# EAGLE design akabeacon_square_type1_ble121 (EAGLE 7.2.0)
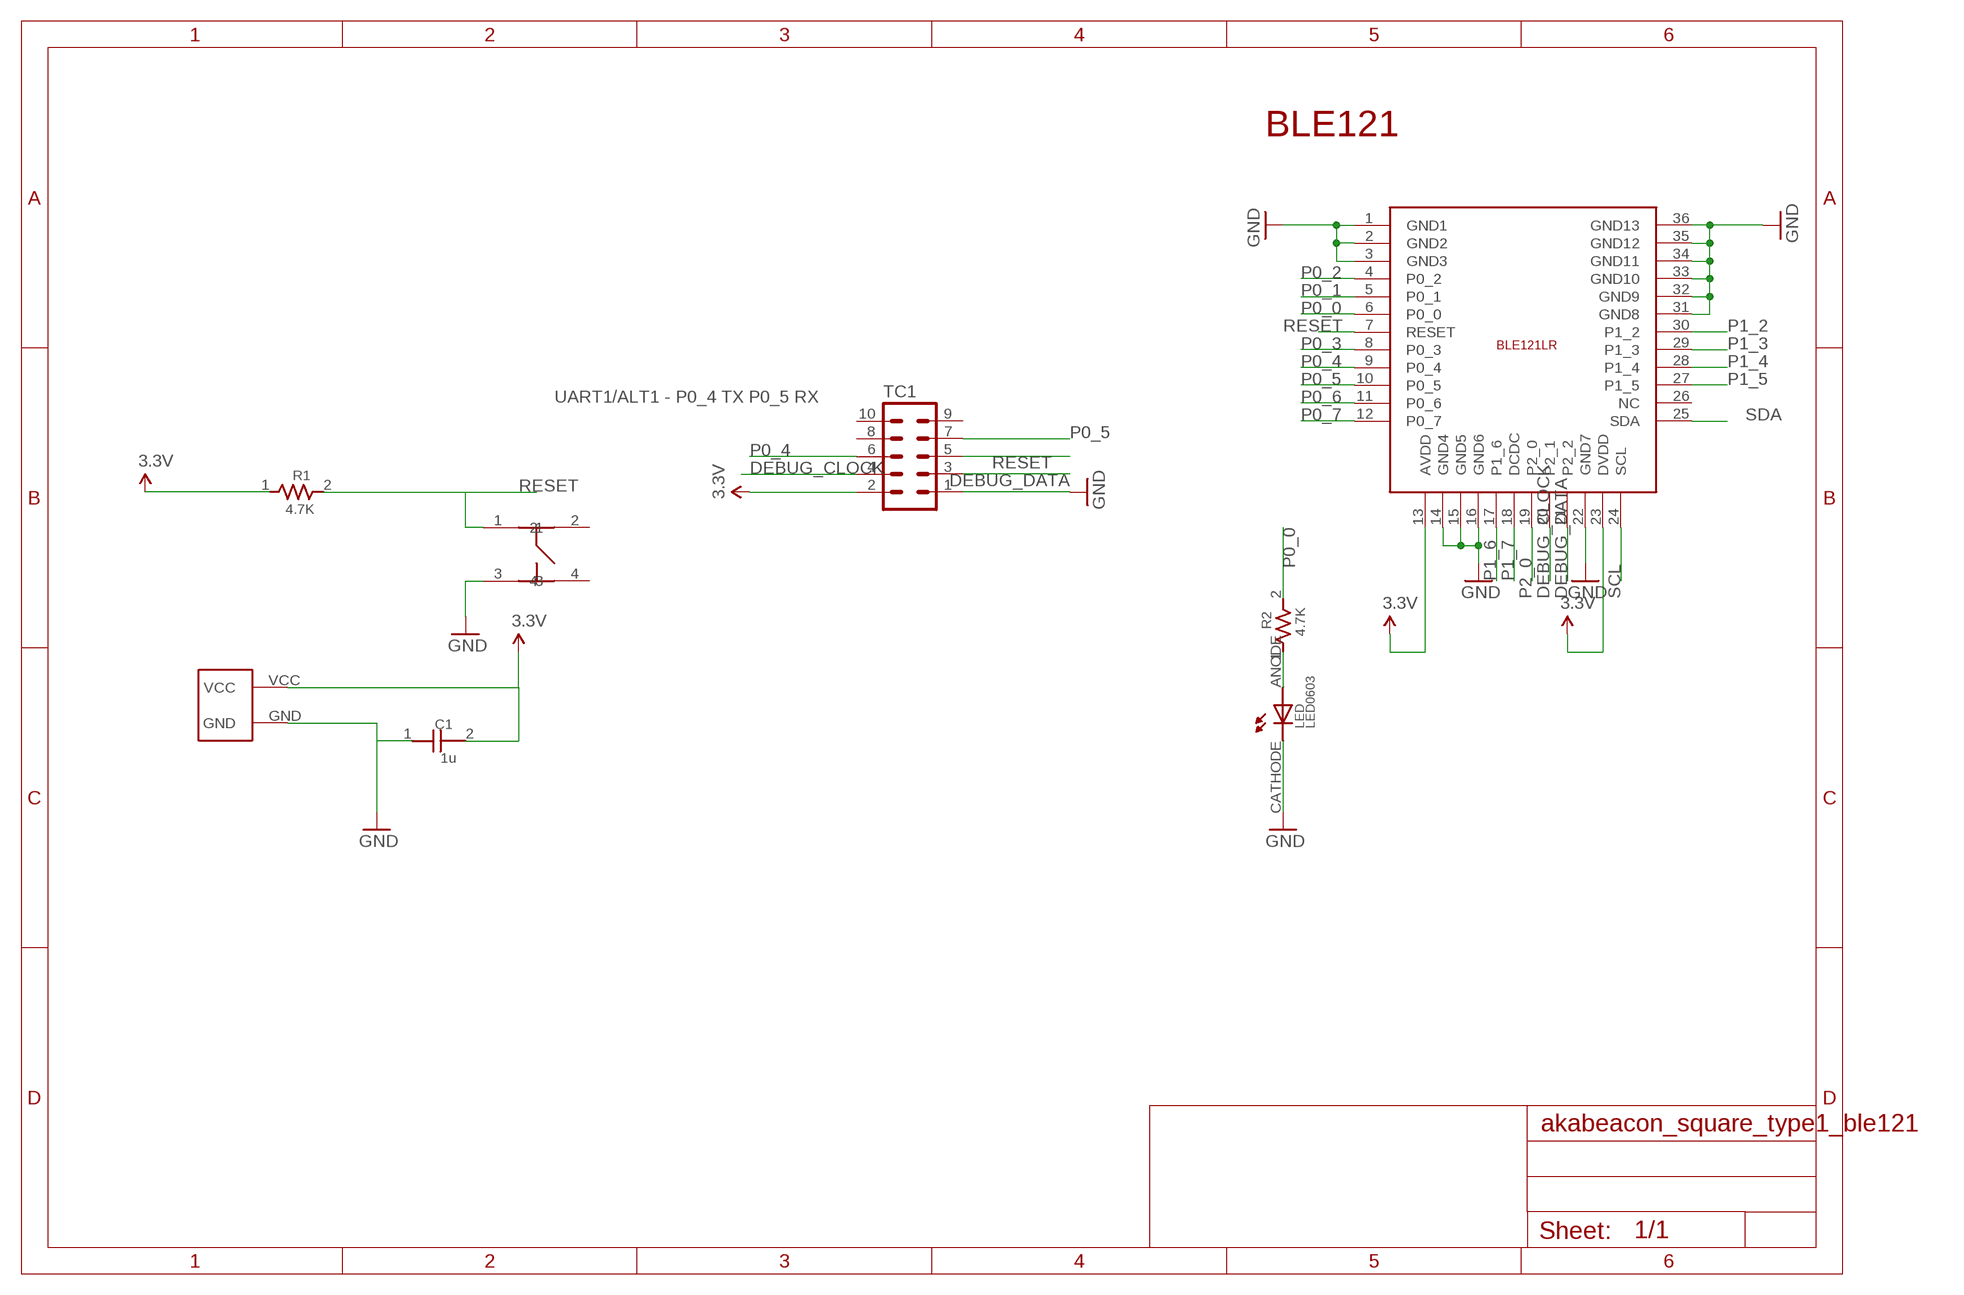
[diagram p0: schematic, sheet 1]

## Parts
BLE1  BLUEGIGA-BLE121LR  [BLUEGIGA-BLE121LR]
C1  1u  CAPACITOR0603  [0603]
LED  LED0603  [0603]
R1  4.7K  RESISTOR0603  [0603]
R2  4.7K  RESISTOR0603  [0603]
TC1  TC2050-IDC-NL  [TC2050-IDC-NL]
U$2  SQUARE-TYPE1  [SQUARE-TYPE1-TC2030]
U$6  SWICTH-4P(KMR2)  [SWITCH-4P(KMR2)]

## Nets
3.3V: BLE1.13(AVDD) BLE1.23(DVDD) C1.2 R1.1 TC1.2 U$2.VCC
DEBUG_CLOCK: BLE1.20(P2_1) TC1.4
DEBUG_DATA: BLE1.21(P2_2) TC1.3
GND: BLE1.1(GND1) BLE1.2(GND2) BLE1.3(GND3) BLE1.22(GND7) BLE1.31(GND8) BLE1.32(GND9) BLE1.33(GND10) BLE1.34(GND11) BLE1.35(GND12) BLE1.36(GND13) C1.1 LED.CATHODE TC1.1 U$2.GND U$6.3
N$2: LED.ANODE R2.1
N$8: BLE1.14(GND4) BLE1.15(GND5) BLE1.16(GND6) ; supply symbol labelled GND
P0_0: BLE1.6(P0_0) R2.2
P0_1: BLE1.5(P0_1)
P0_2: BLE1.4(P0_2)
P0_3: BLE1.8(P0_3)
P0_4: BLE1.9(P0_4) TC1.6
P0_5: BLE1.10(P0_5) TC1.7
P0_6: BLE1.11(P0_6)
P0_7: BLE1.12(P0_7)
P1_2: BLE1.30(P1_2)
P1_3: BLE1.29(P1_3)
P1_4: BLE1.28(P1_4)
P1_5: BLE1.27(P1_5)
P1_6: BLE1.17(P1_6)
P1_7: BLE1.18(DCDC)
P2_0: BLE1.19(P2_0)
RESET: BLE1.7(RESET) R1.2 TC1.5 U$6.1
SCL: BLE1.24(SCL)
SDA: BLE1.25(SDA)
Unconnected: BLE1.26(NC) TC1.8 TC1.9 TC1.10 U$6.2 U$6.4

## Notes on the sheet
- BLE121
- UART1/ALT1 - P0_4 TX P0_5 RX

## Library data of the parts
BLE1 = gclueBT:BLUEGIGA-BLE121LR: Bluetooth Bluetooth 4.0 low energy radio Radio Transmit power: +8 dBm Receiver sensitivity: -98 dBm Typical line-of-sight range: up to 450 meters Current Consumption TX peak current: 36 mA, 25 mA (with DC/DC) RX peak current: 33 mA Power mode 1: 2.7 mA Power mode 2: 1.3 uA Power mode 3: 0.5 uA Certifications Japan: MIC Japan certification ( 209-J00111 )
C1 = GClue-Capacitor:CAPACITOR
LED = GClue-LED:LED
R1 R2 = GClue-Resistors:RESISTOR
TC1 = TagConnect:TC2050-IDC: Tag-Connect In Circuit Programming & Debug Cable 10 Pin http://www.tag-connect.com
U$2 = GClue-Beacon:SQUARE-TYPE1
U$6 = gclue:SWICTH-4P(KMR2)

## Board
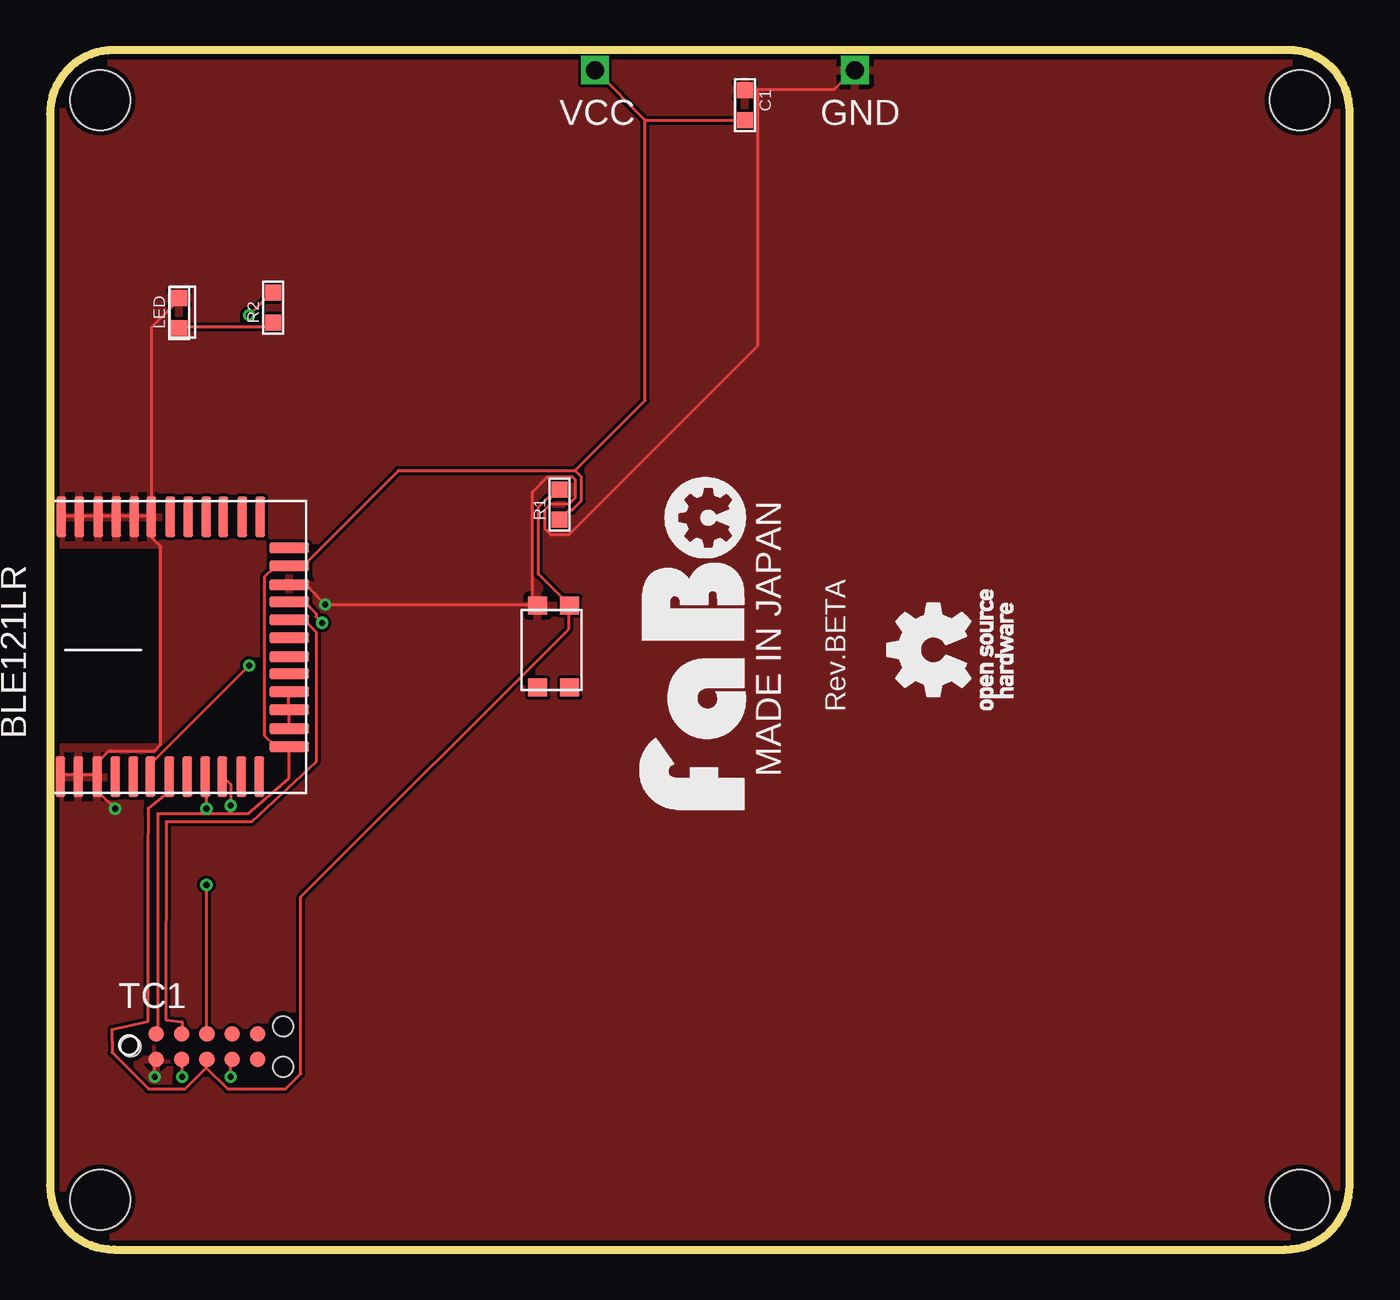
[diagram p1: board, top side]
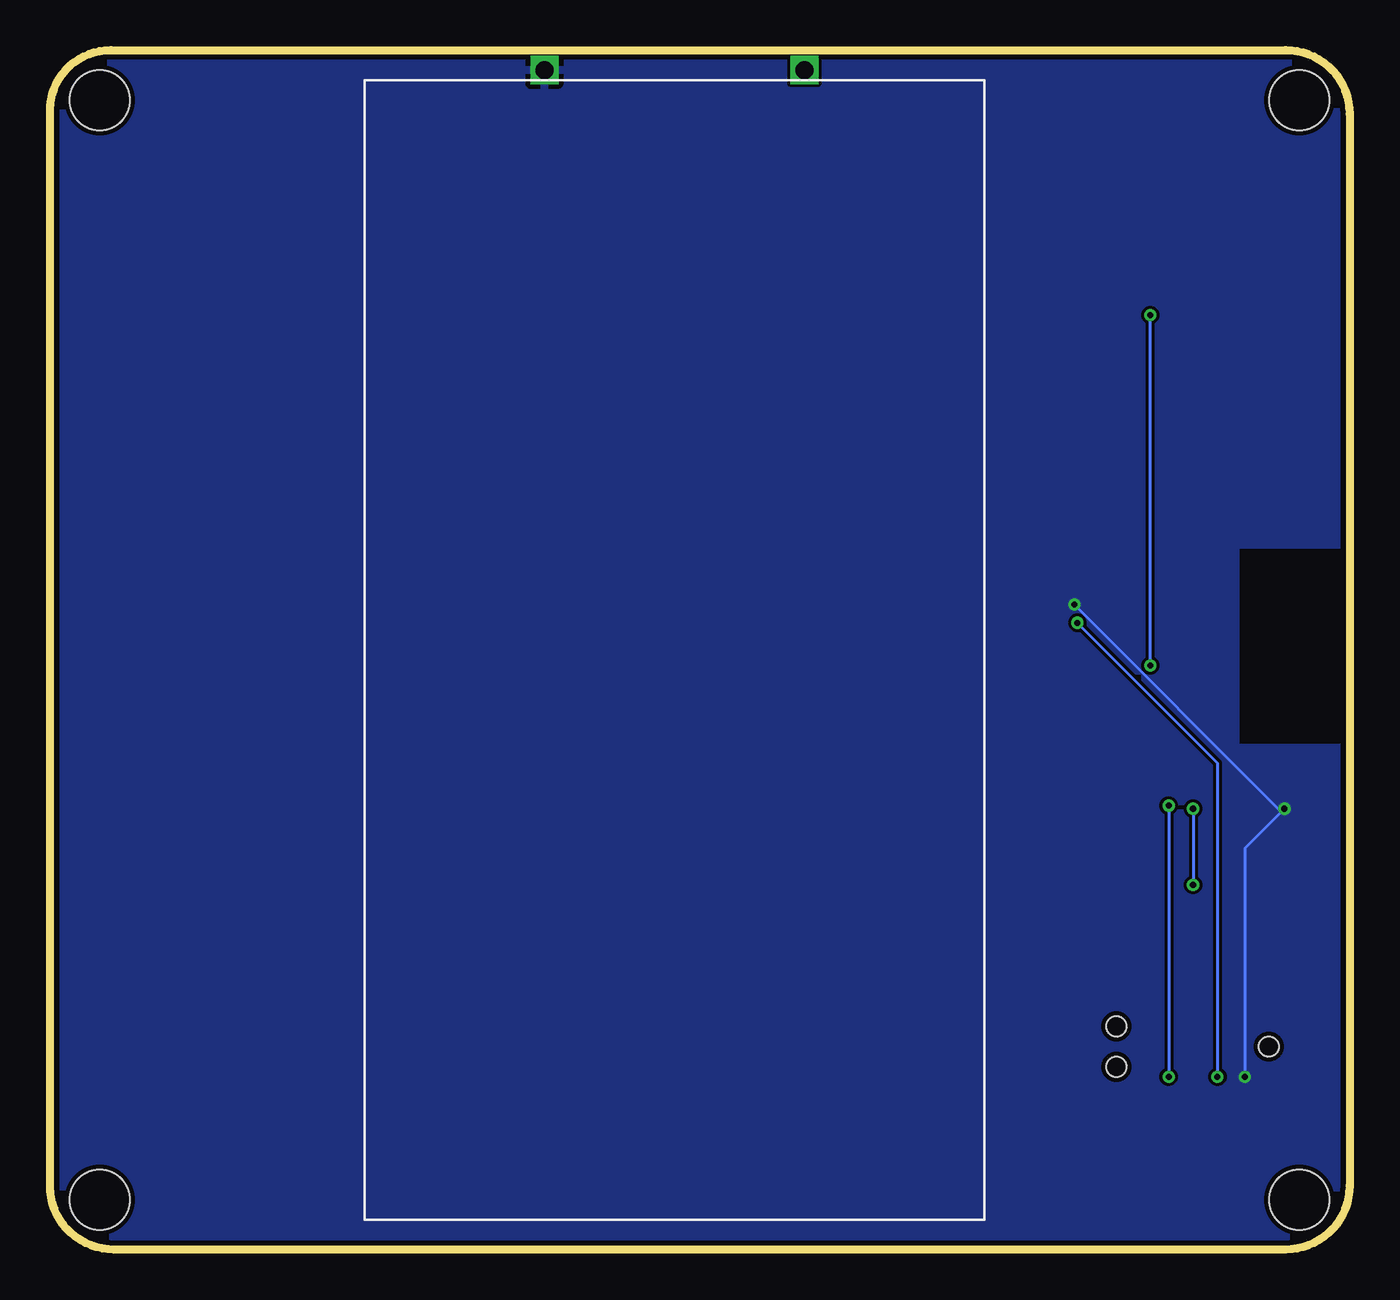
[diagram p2: board, bottom side, seen from below]

Size 65 x 60 mm. Coordinates in mm from the lower left corner, seen from the top.
Copper layers (1*16): Top 0.035mm / dielectric 1.5mm / Bottom 0.035mm
Design rules "SeeedStudio_2layer_DRU_no_angle_20140221": minimum track width 6mil, minimum drill 12mil, track to track 6mil, track to pad 6mil, pad to pad 6mil, via to via 6mil, smd to smd 0mil, copper to edge 10mil, drill to drill 10mil, minimum pad ring 10mil, minimum via ring 6mil, stop-mask expansion 2mil, vias tented up to drill 100mil, thermal gap 10mil
tRestrict: area -4.2,25.3 to 5.4,35
bRestrict: area -4.2,25.3 to 5.5,35

### Footprints (pad centres in the part's own frame; a part is rotated, then mirrored left to right if it is on the bottom)
BLUEGIGA-BLE121LR = smd 2 x 0.5: 1 -6.4,4.8; 2 -6.4,3.9; 3 -6.4,2.95; 4 -6.4,2.05; 5 -6.4,1.15; 6 -6.4,0.3; 7 -6.4,-0.65; 8 -6.4,-1.55; 9 -6.4,-2.45; 10 -6.4,-3.3; 11 -6.4,-4.25; 12 -6.4,-5.15; 25 6.6,-5.2; 26 6.6,-4.3; 27 6.6,-3.35; 28 6.6,-2.5; 29 6.6,-1.6; 30 6.6,-0.7; 31 6.6,0.25; 32 6.6,1.1; 33 6.6,2; 34 6.6,2.9; 35 6.6,3.85; 36 6.6,4.75 | smd 0.5 x 2: 13 -4.9,-6.65; 14 -4,-6.65; 15 -3.05,-6.65; 16 -2.15,-6.65; 17 -1.25,-6.65; 18 -0.4,-6.65; 19 0.55,-6.65; 20 1.45,-6.65; 21 2.35,-6.65; 22 3.2,-6.65; 23 4.15,-6.65; 24 5.05,-6.65
0603 = smd 0.8 x 0.8: 1 -0.75,0; 2 0.75,0
0603' = smd 0.8 x 0.8: ANODE -0.75,0; CATHODE 0.75,0
TC2050-IDC-NL = smd 0.787 x 0.787: 1 -2.54,-0.635; 2 -2.54,0.635; 3 -1.27,-0.635; 4 -1.27,0.635; 5 0,-0.635; 6 0,0.635; 7 1.27,-0.635; 8 1.27,0.635; 9 2.54,-0.635; 10 2.54,0.635 | hole 0.991: -3.81,0; 3.81,1.016; 3.81,-1.016
SQUARE-TYPE1-TC2030 = drill 0.9 square: GND 7.77,29; VCC -5.23,29 | hole 3: 30.02,27.48; 30.02,-27.52; -29.98,-27.52; -29.98,27.48
SWITCH-4P(KMR2) = smd 0.9 x 0.95: 1 -1,0; 2 3.1,0; 3 -1,-1.6; 4 3.1,-1.6

### Placement (x,y rotation side)
BLE1  5.32,30.05 90 top
C1  34.76,57.23 270 top
LED  LED0603  [0603']  6.46,46.84 90 top
R1  25.49,37.26 90 top
R2  11.16,47.12 90 top
TC1  7.85,10.15 0 top
U$2  32.5,30 0 top
U$6  25.99,31.21 270 top

### Tracks (layer width: path | path; a pad name or v marks a point on that pad's centre or on a via)
3.3V
  Top 0.152: TC1.2 5.39,10.93 5.39,17.02 5.39,21.8 9.9,21.8 11.94,23.57 11.94,25.1 BLE1.13 11.94,25.25 11.18,25.25 10.72,25.71 10.72,33.63 11.18,34.09 11.94,34.09 BLE1.23 12.09,34.24 12.7,34.24 17.43,38.97 26.26,38.97 | 29.77,56.49 34.65,56.49 C1.2 | 29.77,56.49 27.33,58.93 U$2.VCC | 26.26,38.97 26.57,38.66 26.57,37.44 26.11,36.99 25.96,36.99 25.5,36.53 R1.1 | 29.77,56.49 29.77,42.47 26.26,38.97
DEBUG_CLOCK
  Top 0.152: TC1.4 6.61,10.93 6.61,11.4 5.8,11.5 5.81,21.4 10.1,21.4 13.31,24.39 13.31,30.89 12.7,31.5 12.09,31.5 BLE1.20
DEBUG_DATA  (via drill 0.3)
  Top 0.152: v6.61,8.64 6.61,9.4 TC1.3 | v13.62,31.35 13.31,31.65 13.31,31.8 12.85,32.26 12.09,32.26 BLE1.21
  Bottom 0.152: v6.61,8.64 6.61,24.34 v13.62,31.35
GND  (via drill 0.3)
  Top 0.152: BLE1.36 0.66,36.68 1.42,36.68 BLE1.35 1.58,36.68 2.34,36.68 BLE1.34 2.49,36.68 3.25,36.68 BLE1.33 3.4,36.68 4.17,36.68 BLE1.32 4.32,36.68 4.93,36.68 BLE1.31 | LED.CATHODE 6.45,47.5 5.08,46.13 5.08,36.68 BLE1.31 | BLE1.1 0.66,23.73 1.27,23.73 BLE1.2 1.42,23.73 2.34,23.73 BLE1.3 | v5.23,8.64 5.23,9.4 TC1.1 | v3.25,22.05 2.49,22.81 2.49,23.57 BLE1.3 | BLE1.31 5.08,36.53 5.08,35.61 5.54,35.16 5.54,25.25 5.23,24.95 2.95,24.95 2.49,24.49 2.49,23.73 BLE1.3 | 35.41,58.02 39.22,58.02 40.13,58.93 U$2.GND | 35.41,58.02 34.8,58.02 C1.1 | 24.13,32.26 v13.77,32.26 12.85,33.18 12.09,33.18 BLE1.22 | 24.13,32.26 24.28,32.26 U$6.3 24.13,32.26 | 35.41,58.02 35.41,45.22 25.96,35.77 25.05,35.77 24.74,36.07 24.74,36.99 25.05,37.29 25.96,37.29 26.26,37.59 26.26,38.51 26.11,38.66 24.89,38.66 24.13,37.9 24.13,32.26
  Bottom 0.152: v5.23,8.64 5.23,20.07 3.4,21.9 | v13.77,32.26 3.4,21.9 | 3.4,21.9 v3.25,22.05
  pour Top: -0.1,-0.2 -0.1,60.8 65.9,60.8 65.9,-0.2
  pour Bottom: -0.1,-0.2 -0.1,60.8 65.9,60.8 65.9,-0.2
N$2
  Top 0.152: LED.ANODE 6.61,46.13 10.87,46.13 11.02,46.28 R2.1
N$8
  Top 0.152: BLE1.14 11.94,26.16 11.94,26.93 BLE1.15 11.94,27.08 11.94,27.84 BLE1.16
P0_0  (via drill 0.3)
  Top 0.152: v9.96,46.74 11.02,47.81 R2.2 | v9.96,29.21 5.08,24.34 5.08,23.73 BLE1.6
  Bottom 0.152: v9.96,29.21 v9.96,46.74
P0_4  (via drill 0.3)
  Top 0.152: v7.82,18.24 7.82,10.93 TC1.6 | v7.82,22.05 7.82,23.57 BLE1.9
  Bottom 0.152: v7.82,22.05 v7.82,18.24
P0_5  (via drill 0.3)
  Top 0.152: v9.04,8.64 9.04,9.4 TC1.7 | v9.04,22.2 9.04,23.27 8.74,23.57 BLE1.10
  Bottom 0.152: v9.04,22.2 v9.04,8.64
RESET
  Top 0.152: R1.2 25.35,37.9 25.05,37.59 24.89,37.59 24.44,37.14 24.44,33.78 25.96,32.26 U$6.1 25.96,32.11 25.96,31.04 12.55,17.63 12.55,8.79 11.79,8.03 8.89,8.03 7.82,9.1 | 7.82,9.1 7.82,9.4 TC1.5 | 7.82,9.1 6.76,8.03 4.93,8.03 3.1,9.86 3.1,11 4.9,11.4 4.9,19.8 4.9,21.8 4.9,22.07 5.84,22.81 5.84,23.57 BLE1.7

### Text on the board
tPlace: Rev.BETA